# Altium schematic sheet DBoard_conn.SchDoc: {Наименование}
size 420 x 297 mm; DocumentNumber: ПЛАС.ХХХХХХ.ХХХ ХХ; SheetNumber: {}; SheetTotal: {}; PageSetup: Record=PageOptions|CenterHorizontal=False|CenterVertical=False|PrintScale=0.95|XCorrection=0.00|YCorrection=0.00|PrintKind=1|BorderSize=5000000|LeftOffset=0|BottomOffset=0|Orientation=1|PaperLength=1000|PaperWidth=1000|Scale=100|PaperSource=15|PrintQuality=600|MediaType=1|DitherType=10|PaperKind=A4|PrintScaleMode=1; Rule: PcbType=ProtelPcb
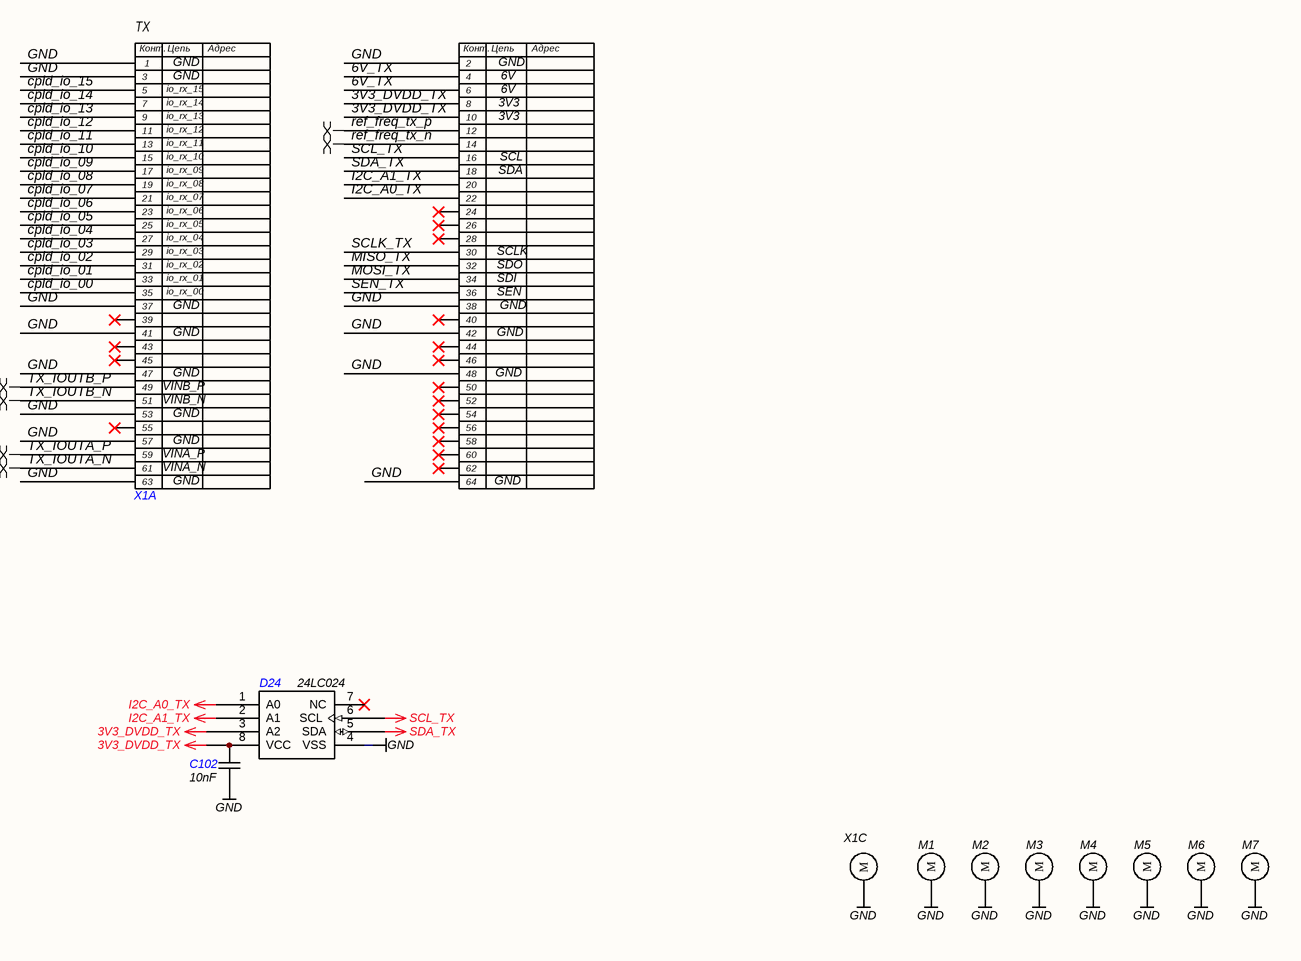
[diagram p0: DBoard_conn.SchDoc]

## Parts
C102  value 10nF  [C0402]  (hidden comment: CAP)
D24  24LC024  [SOIC_SN8]
M1  Via  [Mechanical_Via_2.6x4.2]  (value not drawn)
M2  Via  [Mechanical_Via_2.6x4.2]  (value not drawn)
M3  Via  [Mechanical_Via_2.6x4.2]  (value not drawn)
M4  Via  [Mechanical_Via_2.6x4.2]  (value not drawn)
M5  Via  [Mechanical_Via_2.6x4.2]  (value not drawn)
M6  Via  [Mechanical_Via_2.6x4.2]  (value not drawn)
M7  Via  [Mechanical_Via_2.6x4.2]  (value not drawn)
X1  DBoard  [DBOARD-HALF-TX-MB]  (value not drawn)  (parts A,C of 3)

## Nets
3V3_DVDD_TX: C102.2 D24.3(A2) D24.8(VCC) X1.8 X1.10
GND: C102.1 D24.4(VSS) M1.0(M) M2.0(M) M3.0(M) M4.0(M) M5.0(M) M6.0(M) M7.0(M) X1.0(M) X1.1 X1.2 X1.3 X1.37 X1.38 X1.41 X1.42 X1.47 X1.48 X1.53 X1.57 X1.63 X1.64
I2C_A0_TX: D24.1(A0) X1.22
I2C_A1_TX: D24.2(A1) X1.20
SCL_TX: D24.6(SCL) X1.16
SDA_TX: D24.5(SDA) X1.18
6V_TX: X1.4 X1.6
cpld_io_00: X1.35
cpld_io_01: X1.33
cpld_io_02: X1.31
cpld_io_03: X1.29
cpld_io_04: X1.27
cpld_io_05: X1.25
cpld_io_06: X1.23
cpld_io_07: X1.21
cpld_io_08: X1.19
cpld_io_09: X1.17
cpld_io_10: X1.15
cpld_io_11: X1.13
cpld_io_12: X1.11
cpld_io_13: X1.9
cpld_io_14: X1.7
cpld_io_15: X1.5
MISO_TX: X1.32
MOSI_TX: X1.34
ref_freq_tx_n: X1.14
ref_freq_tx_p: X1.12
SCLK_TX: X1.30
SEN_TX: X1.36
TX_IOUTA_N: X1.61
TX_IOUTA_P: X1.59
TX_IOUTB_N: X1.51
TX_IOUTB_P: X1.49

Not connected (* = marked no-connect by the designer): D24 7(NC)*; X1 24* 26* 28* 39* 40* 43* 44* 45* 46* 50* 52* 54* 55* 56* 58* 60* 62*

## Layout directives
differential pair: ref_freq_tx_n, ref_freq_tx_p, TX_IOUTA_N, TX_IOUTA_P, TX_IOUTB_N, TX_IOUTB_P

## Notes on the sheet
- (near X1) io_rx_15
- (near X1) io_rx_14
- (near X1) GND
- (near X1) 3V3
- (near X1) 6V
- (near X1) io_rx_13
- (near X1) io_rx_12
- (near X1) io_rx_11
- (near X1) io_rx_10
- (near X1) io_rx_09
- (near X1) SDA
- (near X1) SCL
- (near X1) io_rx_08
- (near X1) io_rx_07
- (near X1) io_rx_06
- (near X1) io_rx_05
- (near X1) io_rx_04
- (near X1) io_rx_03
- (near X1) io_rx_02
- (near X1) io_rx_01
- (near X1) io_rx_00
- (near X1) SCLK
- (near X1) SDO
- (near X1) SDI
- (near X1) SEN
- (near X1) VINB_P
- (near X1) VINB_N
- (near X1) VINA_P
- (near X1) VINA_N
- Подп. и дата
- Инв. № дубл.
- Взам. инв. №
- Инв. № подл.
- Лист
- Изм.
- № докум.
- Подп.
- Дата
- Копировал
- Формат А3
- (in symbol DBoard, part A) TX; Конт.; Цепь; Адрес

## Library data of the parts
C102 = CAP: SMD Capacitor; Manufacturer: Murata; Material: X7R; Tolerance: 10%; Voltage: 25V; Type: Ceramic Capacitor; P/N: GRM155R71E103KA01D; Supplier 1: Digi-key; Supplier Part Number 1: 490-1312-1-ND; Supplier 2: Mouser; Supplier Part Number 2: 81-GRM36X103K25; Supplier 3: Farnell; Supplier Part Number 3: *
D24 = 24LC024: I2C EEPROM; Manufacturer: Microchip; Capacity: 2kbit; Max Clock: 400 kHz; Voltage: 2.5-5.5V; P/N: 24LC024HT-I/SN; Name: 24LC024; Package: SOIC-8; Type: I2C EEPROM; Value: 24LC024; Supplier 1: Digi-key; Supplier Part Number 1: 24LC024HT-I/SNCT-ND; Supplier 2: Mouser; Supplier Part Number 2: 579-24LC024HT-I/SN; Supplier 3: Farnell; Supplier Part Number 3: *
M1-M7 = Mechanical Via: Supplier 4: Digi-key; Supplier Part Number 4: *; Supplier 5: Mouser; Supplier Part Number 5: *; Supplier 6: Farnell; Supplier Part Number 6: *
X1 = DBoard: USRP DBoard; Manufacturer: Molex; Name: 1.00mm Pitch Mezzanine 714390164; P/N: 714390164; Supplier 1: Digi-Key; Supplier Part Number 1: WM17201-ND; Supplier 2: Mouser; Supplier Part Number 2: 538-71439-0164; Supplier 3: Farnell; Supplier Part Number 3: *